# Altium project Ozgun_UKB_2025-2026.PrjPcb (part 3 of 4)
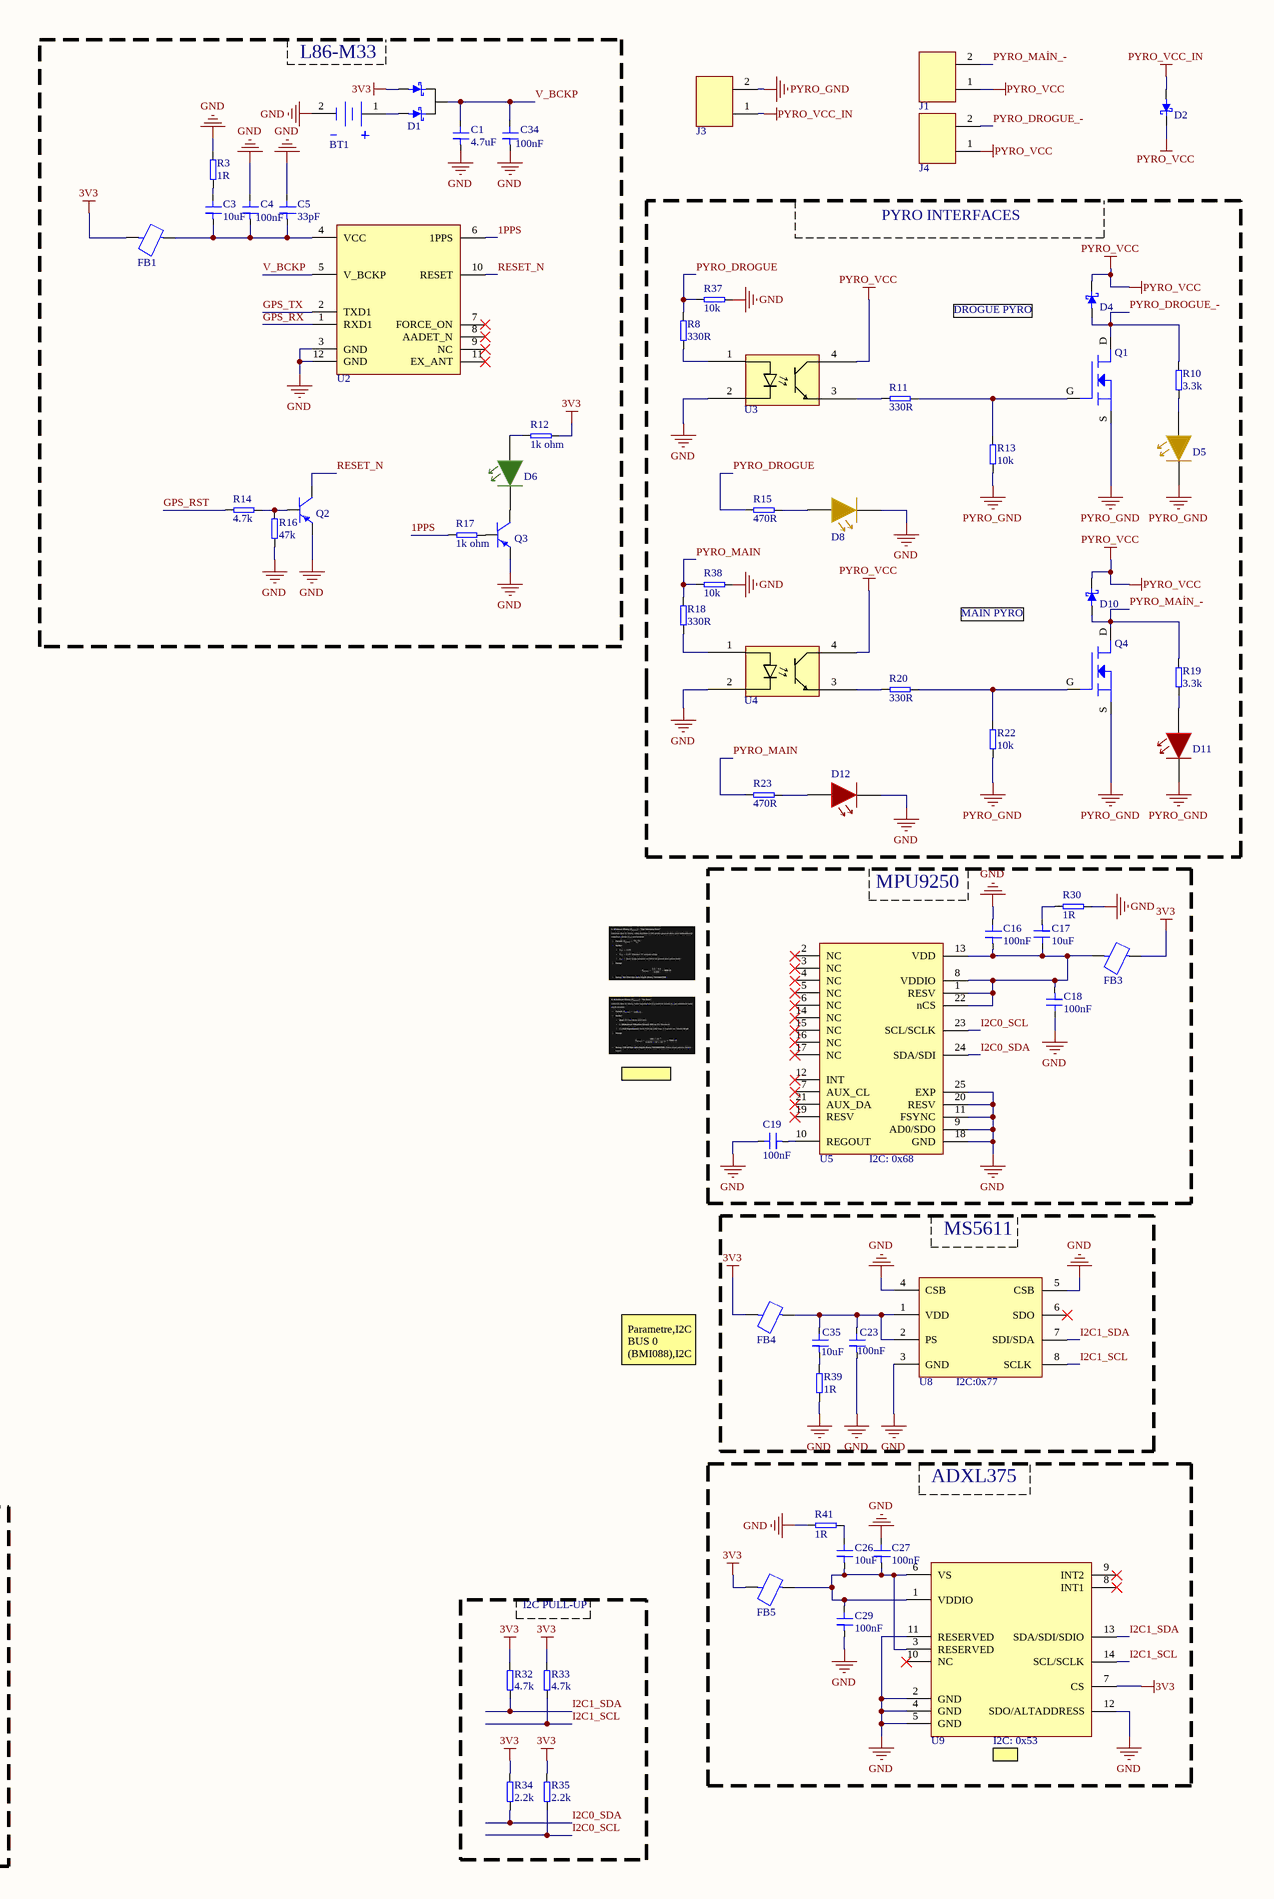
[diagram p3: Ucus_Kontrol_Bilgisayari.SchDoc, right]

## Sheet Ucus_Kontrol_Bilgisayari.SchDoc: AZAK ROKET TAKIMI ÖZGÜN UÇUŞ KONTROL BİLGİSAYARI (continued)

### Library data of the parts (continued)
D5 D8 = LED YELLOW 0805: Single Color LED, Brilliant Yellow, Water Clear, 1.4mm; Manufacturer: Everlight; Manufacturer Part Number: 17-21/Y2C-AN1P2/4T; Forward Current: 25mA; Forward Voltage: 2.4V; Luminous Intensity: 28.5mcd; Number of Circuits: 1; Peak Wavelength: 591nm; Reverse Voltage: 5V; Shape: Rectangular; Supplier: Future Electronics; Supplier Part Number: 6159094; RoHS: Compliant; Category: LEDs; Pricing: 4000=0,0337, 12000=0,0329, 20000=0,0326, 60000=0,0318, 100000=0,0311 (USD); Height: 1mm; Lifecycle Status: Production; Max Operating Temperature: 85°C; Min Operating Temperature: -40°C; Mounting Technology: Surface Mount; Number of Terminals: 2; REACH SVHC: Yes; Terminal Pitch: 1.6mm; Viewing Angle: 140°; ComponentLink1URL: https://datasheet.octopart.com:443/17-21-Y2C-AN1P2-4T-Everlight-datasheet-155996644.pdf?src-supplier=IHS; ComponentLink1Description: https://datasheet.octopart.com:443/17-21-Y2C-AN1P2-4T-Everlight-datasheet-155996644.pdf?src-supplier=IHS; ComponentLink2Description: Tedarikçi; ComponentLink2URL: https://www.ozdisan.com/p/sinyal-ledler-tek-renkli-361/everlight-17-21-y2c-an1p2-4t-952251
D7 D9 = D1FH3-5053: 30V, 3A, SMD Schottky Barrier Diode with 60A Surge; 1F Package Type; Manufacturer: Shindengen; Number of Elements: 1; Supplier: Mouser; Supplier Part Number: 627-D1FH35053; Manufacturer Part Number: D1FH3-5053; RoHS: Compliant; Category: Rectifier Diodes; Stock: 1555; Pricing: 1=0,93, 10=0,804, 50=0,804, 100=0,557, 1000=0,404, 10000=0,309 (USD); Lifecycle Status: Production; Max Forward Surge Current (Ifsm): 60A; Max Operating Temperature: 125°C; Max Output current: 3A; Number of Terminals: 2; REACH SVHC: No; Reverse Standoff Voltage: 30V; ComponentLink1URL: https://datasheet.octopart.com:443/D1FH3-5053-Shindengen-datasheet-38891300.pdf?src-supplier=IHS; ComponentLink1Description: https://datasheet.octopart.com:443/D1FH3-5053-Shindengen-datasheet-38891300.pdf?src-supplier=IHS; ComponentLink2Description: Tedarikçi; ComponentLink2URL: https://www.ozdisan.com/p/schottky-diyotlar-385/shindengen-d1fh3-5053-645670
D11 D12 D14 = LED RED 0805: Single Color LED, Brilliant Red, Water Clear, 1.4mm; Manufacturer: Everlight; Manufacturer Part Number: 17-21/R6C-AP1Q2L/4T; Forward Current: 25mA; Forward Voltage: 2.3V; Luminous Intensity: 45mcd; Number of Circuits: 1; Peak Wavelength: 632nm; Reverse Voltage: 5V; Shape: Rectangular; Viewing Angle: 140°; Supplier: Future Electronics; Supplier Part Number: 3156045; RoHS: Compliant; Category: LEDs; Pricing: 4000=0,0312, 12000=0,0305, 20000=0,0301, 60000=0,0294, 100000=0,0288 (USD); Height: 1mm; Lifecycle Status: Production; Max Operating Temperature: 85°C; Min Operating Temperature: -40°C; Mounting Technology: Surface Mount; Number of Terminals: 2; REACH SVHC: Yes; ComponentLink1URL: https://datasheet.octopart.com:443/17-21-R6C-AP1Q2L-4T-Everlight-datasheet-116384818.pdf?src-supplier=IHS; ComponentLink1Description: https://datasheet.octopart.com:443/17-21-R6C-AP1Q2L-4T-Everlight-datasheet-116384818.pdf?src-supplier=IHS; ComponentLink2Description: Tedarikçi; ComponentLink2URL: https://www.ozdisan.com/p/sinyal-ledler-tek-renkli-361/everlight-17-21-r6c-ap1q2l-4t-752951
D15 = 1.5SMCJ14A_R2_00001: Tepe Darbe Akımı (Maks) (Ippm): 64.7 A; Güç (Tepe Darbe): 1.5 kW; Yön: Uni-Direction; Diyot Konfigürasyonu: Single; TVS Diyot Tipi: Standard; ComponentLink1Description: Tedarikçi; ComponentLink1URL: https://www.ozdisan.com/p/tvs-diyotlar-386/panjit-1-5smcj14a-r2-00001-566508; Voltaj - Ters Standoff (Typ): 14 V; Montaj Tipi: SMT; Kılıf / Kasa: DO214AB (SMC)
D16 = P6SMBJ10AS_R1_00001: Trans Voltage Suppressor Diode, 600W, 10V V(RWM), Unidirectional, 1 Element, Silicon; Manufacturer: Panjit; Breakdown Voltage: 11.7V; Clamping Voltage: 17V; Max Breakdown Voltage: 12.3V; Max Power Dissipation: 5W; Min Breakdown Voltage: 11.1V; Number of Elements: 1; Peak Reverse Current: 5µA; Supplier: Mouser; Supplier Part Number: 241-P6SMBJ10ASR10000; Manufacturer Part Number: P6SMBJ10AS_R1_00001; RoHS: Compliant; Category: TVS Diodes; Pricing: 1=0,4, 10=0,248, 50=0,248, 100=0,157, 1000=0,094, 10000=0,094 (USD); Export Control Classification Number (ECCN) Code: EAR99; Harmonized Tariff Schedule (HTS) Code: 8541.10.00.50; Introduction Date: 2020-05-25; Lifecycle Status: Production; Max Operating Temperature: 150°C; Min Operating Temperature: -55°C; Number of Terminals: 2; Peak Pulse Power: 600W; Polarity: Unidirectional; REACH SVHC: No; Reverse Standoff Voltage: 10V; ComponentLink1URL: https://datasheet.octopart.com:443/P6SMBJ10AS_R1_00001-Panjit-datasheet-180982218.pdf?src-supplier=IHS; ComponentLink1Description: https://datasheet.octopart.com:443/P6SMBJ10AS_R1_00001-Panjit-datasheet-180982218.pdf?src-supplier=IHS; ComponentLink2Description: Tedarikçi; ComponentLink2URL: https://www.ozdisan.com/p/tvs-diyotlar-386/panjit-p6smbj10as-r1-00001-642916
FB1 FB3-FB5 = FERRİTE BEAD 0603 600R: Ferrite Beads Multi-Layer 600Ohm 25% 100MHz 500mA 350mOhm DCR 0603 Paper T/R; Manufacturer Part Number: BLM18EG601SN1D; DC Resistance (DCR): 350mΩ; Impedance: 700Ω; Material: Ferrite, Steel; Clock Frequency: 1GHz; Number of Circuits: 1; Value: 350mΩ; Shielding: Unshielded; ComponentLink1Description: Tedarikçi; ComponentLink1URL: https://www.ozdisan.com/p/bead-feritler-469/murata-blm18eg601sn1d-649375; Supplier: Mouser; Supplier Part Number: 81-BLM18EG601SN1D; Manufacturer: Murata; RoHS: Compliant; Category: Ferrite Beads and Chips; Stock: 195850; Pricing: 1=0,23, 10=0,163, 50=0,127, 100=0,114, 1000=0,075, 10000=0,058 (USD); Case/Package: 0603; Case Code (Imperial): 0603; Case Code (Metric): 1608; Contact Plating: Tin; Core Material: Ferrite; Current Rating: 500mA; DC Current: 500mA; Depth: 800µm; Frequency: 100MHz; Height: 800µm; Lead Free: Lead Free; Length: 1.6mm; Lifecycle Status: Production; Max Current Rating: 500mA; Max DC Current: 500mA; Max Operating Temperature: 125°C; Military Standard: Not; Min Operating Temperature: -55°C; Number of Lines: 1; Pins: 2; Number of Terminals: 2; Packaging: Cut Tape; Radiation Hardening: No; REACH SVHC: Yes; RMS Current (Irms): 500mA; Schedule B: 8504500000, 8504500000|8504500000|8504500000|8504500000|8504500000; ESR: 350mΩ; Termination: SMD/SMT; Test Frequency: 100MHz; Tolerance: 25%; Width: 800µm; ComponentLink2URL: https://datasheet.octopart.com:443/BLM18EG601SN1D-Murata-datasheet-165300960.pdf?src-supplier=IHS; ComponentLink2Description: https://datasheet.octopart.com:443/BLM18EG601SN1D-Murata-datasheet-165300960.pdf?src-supplier=IHS; ComponentLink3URL: https://datasheet.octopart.com:443/BLM18EG601SN1D-Murata-datasheet-66919.pdf?src-supplier=element14+APAC; ComponentLink3Description: https://datasheet.octopart.com:443/BLM18EG601SN1D-Murata-datasheet-66919.pdf?src-supplier=element14+APAC; ComponentLink4URL: https://datasheet.octopart.com:443/BLM18EG601SN1D-Murata-datasheet-11550679.pdf?src-supplier=_legacy+Avnet; ComponentLink4Description: https://datasheet.octopart.com:443/BLM18EG601SN1D-Murata-datasheet-11550679.pdf?src-supplier=_legacy+Avnet; ComponentLink5URL: https://datasheet.octopart.com:443/BLM18EG601SN1D-Murata-datasheet-8330444.pdf?src-supplier=_legacy+Avnet; ComponentLink5Description: https://datasheet.octopart.com:443/BLM18EG601SN1D-Murata-datasheet-8330444.pdf?src-supplier=_legacy+Avnet; ComponentLink6URL: https://datasheet.octopart.com:443/BLM18EG601SN1D-Murata-datasheet-584887.pdf?src-supplier=_legacy+Avnet; ComponentLink6Description: https://datasheet.octopart.com:443/BLM18EG601SN1D-Murata-datasheet-584887.pdf?src-supplier=_legacy+Avnet; ComponentLink7URL: https://datasheet.octopart.com:443/BLM18EG601SN1D-Murata-datasheet-141257939.pdf?src-supplier=Ciiva; ComponentLink7Description: https://datasheet.octopart.com:443/BLM18EG601SN1D-Murata-datasheet-141257939.pdf?src-supplier=Ciiva; ComponentLink8URL: https://datasheet.octopart.com:443/BLM18EG601SN1D-Murata-datasheet-138707008.pdf?src-supplier=Ciiva; ComponentLink8Description: https://datasheet.octopart.com:443/BLM18EG601SN1D-Murata-datasheet-138707008.pdf?src-supplier=Ciiva; ComponentLink9URL: https://datasheet.octopart.com:443/BLM18EG601SN1D-Murata-datasheet-113093584.pdf?src-supplier=Ciiva; ComponentLink9Description: https://datasheet.octopart.com:443/BLM18EG601SN1D-Murata-datasheet-113093584.pdf?src-supplier=Ciiva; ComponentLink10URL: https://datasheet.octopart.com:443/BLM18EG601SN1D-Murata-datasheet-135086666.pdf?src-supplier=TME; ComponentLink10Description: https://datasheet.octopart.com:443/BLM18EG601SN1D-Murata-datasheet-135086666.pdf?src-supplier=TME; ComponentLink11URL: https://datasheet.octopart.com:443/BLM18EG601SN1D-Murata-datasheet-62086314.pdf?src-supplier=Future+Electronics; ComponentLink11Description: https://datasheet.octopart.com:443/BLM18EG601SN1D-Murata-datasheet-62086314.pdf?src-supplier=Future+Electronics; ComponentLink12URL: https://datasheet.octopart.com/BLM18EG601SN1D-Murata-datasheet-37129980.pdf; ComponentLink12Description: https://datasheet.octopart.com/BLM18EG601SN1D-Murata-datasheet-37129980.pdf; ComponentLink13URL: https://datasheet.octopart.com:443/BLM18EG601SN1D-Murata-datasheet-8430085.pdf?src-supplier=Jameco; ComponentLink13Description: https://datasheet.octopart.com:443/BLM18EG601SN1D-Murata-datasheet-8430085.pdf?src-supplier=Jameco; ComponentLink14URL: http://sigma.octopart.com:80/reach_statement/Murata-company-16.pdf?src-supplier=Compliance+Statements; ComponentLink14Description: http://sigma.octopart.com:80/reach_statement/Murata-company-16.pdf?src-supplier=Compliance+Statements
FB2 FB6 = FERRİTE BEAD 0805 180R 4A: Ferrite Beads Multi-Layer Power 180Ohm 25% 100MHz 4A 0.02Ohm DCR 0805 T/R Automotive AEC-Q200; Manufacturer: Murata; Manufacturer Part Number: BLM21SP181SZ1D; Current Rating: 2.6A; DC Resistance (DCR): 20mΩ; Impedance: 180Ω; Number of Circuits: 1; Value: 20mΩ; Supplier: Mouser; Supplier Part Number: 81-BLM21SP181SZ1D; RoHS: Compliant; Category: Ferrite Beads and Chips; Stock: 11553; Pricing: 1=0,2, 10=0,167, 50=0,146, 100=0,138, 1000=0,106, 10000=0,094 (USD); Case/Package: 0805; Contact Plating: Tin; Core Material: Ferrite; Export Control Classification Number (ECCN) Code: EAR99; Height: 850µm; Harmonized Tariff Schedule (HTS) Code: 8504.50.80.00; Introduction Date: 2018-03-21; Length: 2mm; Lifecycle Status: Production; Max Operating Temperature: 125°C; Min Operating Temperature: -55°C; Number of Terminals: 2; REACH SVHC: Yes; RMS Current (Irms): 4A; Schedule B: 8504500000, 8543706000, 8543706000|8543706000|8543706000|8543706000|8543706000; ESR: 20mΩ; Test Frequency: 100MHz; Tolerance: 25%; Width: 1.25mm; ComponentLink1URL: https://datasheet.octopart.com:443/BLM21SP181SZ1D-Murata-datasheet-180807134.pdf?src-supplier=Newark; ComponentLink1Description: https://datasheet.octopart.com:443/BLM21SP181SZ1D-Murata-datasheet-180807134.pdf?src-supplier=Newark; ComponentLink2URL: https://datasheet.octopart.com:443/BLM21SP181SZ1D-Murata-datasheet-138707467.pdf?src-supplier=ODG+(Origin+Data+Global); ComponentLink2Description: https://datasheet.octopart.com:443/BLM21SP181SZ1D-Murata-datasheet-138707467.pdf?src-supplier=ODG+(Origin+Data+Global); ComponentLink3URL: http://sigma.octopart.com:80/reach_statement/Murata-company-16.pdf?src-supplier=Compliance+Statements; ComponentLink3Description: http://sigma.octopart.com:80/reach_statement/Murata-company-16.pdf?src-supplier=Compliance+Statements; ComponentLink4Description: Tedarikçi
  FB2: ComponentLink4URL: https://www.ozdisan.com/p/bead-feritler-469/murata-blm21sp181sz1d-650133?s=BLM21SP181SZ1D
  FB6: ComponentLink4URL: https://www.ozdisan.com/p/bead-feritler-469/murata-blm21sp181sz1d-650133https://www.ozdisan.com/p/bead-feritler-469/murata-blm21sp181sz1d-650133
J1-J4 = XT30: Konnektör Boyu: 13.70 mm; Gövde Kalınlığı: 5.20 mm; Gövde Genişliği: 10.20 mm; Pad Çapı (X/Y): 4.50 mm; Delik Çapı (Hole): 2.60 mm; Pin 1 - Pin 2 Aralığı: 5.00 mm; ComponentLink1Description: Datasheet; ComponentLink1URL: https://datasheet.octopart.com/XT30U-M-Amass-datasheet-165556442.pdf?src-supplier=TME; ComponentLink2Description: Tedarikçi; ComponentLink2URL: https://www.pilpaketi.com/xt30-erkek-disi-soket-takim-konnektor
J5 = USB4105-GF-A: USB Connector, 24 Contact(s), Female, Right Angle, Solder Terminal, Locking, Receptacle; Manufacturer: Global Connector Technology; Contact Resistance: 50mΩ; Current Rating: 6.25A; Dielectric Material: Liquid Crystal Polymer; Insulation Resistance: 100MΩ; Number of Contacts: 16; Number of Ports: 1; USB Standard: USB 2.0; Voltage Rating: 20V; ComponentLink1Description: Tedarikçi; ComponentLink1URL: https://www.ozdisan.com/p/usb-konnektorler-357/gct-usb4105-gf-a-955183; Supplier: Mouser; Supplier Part Number: 640-USB4105-GF-A; Manufacturer Part Number: USB4105-GF-A; RoHS: Compliant; Category: USB Connectors; Stock: 282614; Pricing: 1=0,78, 1=0,671, 10=0,659, 10=0,567, 25=0,506, 50=0,588, 100=0,56, 100=0,482, 250=0,452, 500=0,416, 800=0,384, 1000=0,447, 4000=0,362, 8000=0,351, 10000=0,408 (USD); China RoHS: Compliant; Contact Gender: Female; Contact Material: Gold, Nickel; Gender: Receptacle; Height: 3.46mm; Lifecycle Status: Production; Max Operating Temperature: 85°C; Min Operating Temperature: -40°C; Pins: 24; Number of Rows: 1; Orientation: Horizontal; REACH SVHC: Yes; Shell Finish: Nickel; Shell Material: Stainless Steel; Terminal Pitch: 500µm; ComponentLink2URL: https://datasheet.octopart.com:443/USB4105-GF-A-GCT-datasheet-166929323.pdf?src-supplier=SOS+electronic; ComponentLink2Description: https://datasheet.octopart.com:443/USB4105-GF-A-GCT-datasheet-166929323.pdf?src-supplier=SOS+electronic; ComponentLink3URL: https://datasheet.octopart.com:443/USB4105-GF-A-GCT-datasheet-188935996.pdf?src-supplier=TME; ComponentLink3Description: https://datasheet.octopart.com:443/USB4105-GF-A-GCT-datasheet-188935996.pdf?src-supplier=TME; ComponentLink4URL: https://datasheet.octopart.com:443/USB4105-GF-A-GCT-datasheet-188869076.pdf?src-supplier=TME; ComponentLink4Description: https://datasheet.octopart.com:443/USB4105-GF-A-GCT-datasheet-188869076.pdf?src-supplier=TME; ComponentLink5URL: https://datasheet.octopart.com:443/USB4105-GF-A-GCT-datasheet-166927665.pdf?src-supplier=TME; ComponentLink5Description: https://datasheet.octopart.com:443/USB4105-GF-A-GCT-datasheet-166927665.pdf?src-supplier=TME
J6 = PDI-09S-5: Right Angle, P.C.B., 5.0mm Footprint; ComponentLink1Description: Datasheet; ComponentLink1URL: https://datasheet.octopart.com/PDI-09S-Power-Dynamics-datasheet-12552829.pdf; ComponentLink2Description: Supplier; ComponentLink2URL: https://www.serelektronik.com.tr/urun/9-pin-pcb-tip-90-disi-d-sub-konnektor; ComponentLink3Description: Tedarikçi; ComponentLink3URL: https://www.ozdisan.com/p/d-sub-konnektorler-297/connfly-ds1037-09fnakt74-346546
L1 = INDUCTOR 3.3uH 6A 20mOhm SMD: Inductor Power Shielded Wirewound 3.3uH 20% 100KHz Iron 6A 0.03Ohm DCR T/R; Manufacturer: Bourns; Core Material: Ferrite; DC Resistance (DCR): 30mΩ; Value: 3.3µH; Number of Circuits: 1; RMS Current (Irms): 7A; Saturation Current: 10A; Shielding: Yes; Supplier: Mouser; Supplier Part Number: 652-SRP7030-3R3M; Manufacturer Part Number: SRP7030-3R3M; RoHS: Compliant; Category: Fixed Inductors; Stock: 731; Pricing: 1=0,9, 10=0,755, 50=0,754, 100=0,642, 1000=0,548, 10000=0,548 (USD); Case/Package: 2725; Composition: Wirewound; Contact Plating: Tin; Current Rating: 6A; DC Current: 6A; Depth: 7mm; Height: 3.2mm; Height - Seated (Max): 3.2004mm; Inductance Tolerance: 20%; Length: 7.8mm; Lifecycle Status: NRND; Material: Ferrite; Max Current Rating: 6A; Max DC Current: 6A; Max Operating Temperature: 125°C; Military Standard: Not; Min Operating Temperature: -40°C; Mounting Technology: Surface Mount; Pins: 2; Number of Terminals: 2; Packaging: Cut Tape; REACH SVHC: Yes; Schedule B: 8504500000, 8504500000|8504500000|8504500000|8504500000|8504500000; Termination: SMD/SMT; Test Frequency: 100kHz; Tolerance: 20%; Width: 6.47mm; ComponentLink1URL: https://datasheet.octopart.com:443/SRP7030-3R3M-Bourns-datasheet-154729963.pdf?src-supplier=Farnell; ComponentLink1Description: https://datasheet.octopart.com:443/SRP7030-3R3M-Bourns-datasheet-154729963.pdf?src-supplier=Farnell; ComponentLink2URL: https://datasheet.octopart.com:443/SRP7030-3R3M-Bourns-datasheet-28808747.pdf?src-supplier=Farnell; ComponentLink2Description: https://datasheet.octopart.com:443/SRP7030-3R3M-Bourns-datasheet-28808747.pdf?src-supplier=Farnell; ComponentLink3URL: https://datasheet.octopart.com:443/SRP7030-3R3M-Bourns-datasheet-21196329.pdf?src-supplier=Electro+Sonic; ComponentLink3Description: https://datasheet.octopart.com:443/SRP7030-3R3M-Bourns-datasheet-21196329.pdf?src-supplier=Electro+Sonic; ComponentLink4URL: https://datasheet.octopart.com:443/SRP7030-3R3M-Bourns-datasheet-11770050.pdf?src-supplier=element14; ComponentLink4Description: https://datasheet.octopart.com:443/SRP7030-3R3M-Bourns-datasheet-11770050.pdf?src-supplier=element14; ComponentLink5URL: https://datasheet.octopart.com:443/SRP7030-3R3M-Bourns-datasheet-8700700.pdf?src-supplier=element14; ComponentLink5Description: https://datasheet.octopart.com:443/SRP7030-3R3M-Bourns-datasheet-8700700.pdf?src-supplier=element14; ComponentLink6URL: https://datasheet.octopart.com:443/SRP7030-3R3M-Bourns-datasheet-8458199.pdf?src-supplier=element14; ComponentLink6Description: https://datasheet.octopart.com:443/SRP7030-3R3M-Bourns-datasheet-8458199.pdf?src-supplier=element14; ComponentLink7URL: https://datasheet.octopart.com:443/SRP7030-3R3M-Bourns-datasheet-34223514.pdf?src-supplier=RS+(Formerly+Allied+Electronics); ComponentLink7Description: https://datasheet.octopart.com:443/SRP7030-3R3M-Bourns-datasheet-34223514.pdf?src-supplier=RS+(Formerly+Allied+Electronics); ComponentLink8URL: https://datasheet.octopart.com:443/SRP7030-3R3M-Bourns-datasheet-24907092.pdf?src-supplier=RS+(Formerly+Allied+Electronics); ComponentLink8Description: https://datasheet.octopart.com:443/SRP7030-3R3M-Bourns-datasheet-24907092.pdf?src-supplier=RS+(Formerly+Allied+Electronics); ComponentLink9URL: http://sigma.octopart.com:80/conflict_mineral_statement/Bourns-company-36.pdf?src-supplier=Compliance+Statements; ComponentLink9Description: http://sigma.octopart.com:80/conflict_mineral_statement/Bourns-company-36.pdf?src-supplier=Compliance+Statements; ComponentLink10Description: Tedarikçi; ComponentLink10URL: https://www.ozdisan.com/p/sabit-induktorler-468/bourns-srp7030-3r3m-500911
LS1 = MTS7525A04LM: Sürücü Devresi: Without Circuit; Empedans: 16 Ohms; Giriş Tipi: Zero-Peak; Voltaj Değeri: 3.60 V; Voltaj Aralığı: 2.5-4.5 V; Frekans: 2.31 kHz; Ses Basınç Seviyesi: 85 dB @ 10cm; Besleme Akımı: 100 mA; Boyut: 7.5x7.5x2.5mm; ComponentLink1Description: Tedarikçi; ComponentLink1URL: https://www.ozdisan.com/p/buzzerlar-430/sound-comp-mts7525a04lm-448634; Teknoloji: Magnetic; Montaj Tipi: SMT
Q1 Q4 = BSC032NE2LSATMA1: Transistor: N-MOSFET; unipolar; 25V; 84A; 37W; PG-TDSON-8; Manufacturer: Infineon; Continuous Drain Current (ID): 22A; Drain to Source Resistance: 4.8mΩ; Gate to Source Voltage (Vgs): 20V; Input Capacitance: 1.2nF; Number of Elements: 1; On-State Resistance: 3.2mΩ; Rise Time: 2.8ns; Supplier: Mouser; Supplier Part Number: 726-BSC032NE2LSATMA1; Manufacturer Part Number: BSC032NE2LSATMA1; RoHS: Compliant; Category: MOSFETs; Stock: 5061; Pricing: 1=0,38, 10=0,376, 50=0,376, 100=0,342, 1000=0,329, 10000=0,268 (USD); China RoHS: Non-Compliant; Contact Plating: Tin; Drain to Source Voltage (Vdss): 25V; Halogen Free: Halogen Free; Lead Free: Contains Lead; Lifecycle Status: Production; Max Dual Supply Voltage: 25V; Max Operating Temperature: 150°C; Max Power Dissipation: 37W; Min Breakdown Voltage: 25V; Min Operating Temperature: -55°C; Mounting Technology: Surface Mount; Pins: 8; Number of Terminals: 8; Package Quantity: 5000; Packaging: Tape & Reel; Power Dissipation: 37W; Rds On Max: 3.2mΩ; REACH SVHC: No; Schedule B: 8541290080, 8541290080|8541290080, 8541290080|8541290080|8541290080, 8541290080|8541290080|8541290080|8541290080; ComponentLink1URL: https://datasheet.octopart.com:443/BSC032NE2LSATMA1-Infineon-datasheet-62293614.pdf?src-supplier=IHS; ComponentLink1Description: https://datasheet.octopart.com:443/BSC032NE2LSATMA1-Infineon-datasheet-62293614.pdf?src-supplier=IHS; ComponentLink2URL: https://datasheet.octopart.com:443/BSC032NE2LS-Infineon-datasheet-180053178.pdf?src-supplier=IHS; ComponentLink2Description: https://datasheet.octopart.com:443/BSC032NE2LS-Infineon-datasheet-180053178.pdf?src-supplier=IHS; ComponentLink3URL: https://datasheet.octopart.com:443/BSC032NE2LSATMA1-Infineon-datasheet-11748125.pdf?src-supplier=Factory+Futures; ComponentLink3Description: https://datasheet.octopart.com:443/BSC032NE2LSATMA1-Infineon-datasheet-11748125.pdf?src-supplier=Factory+Futures; ComponentLink4URL: http://sigma.octopart.com:80/conflict_mineral_statement/Infineon-company-51.pdf?src-supplier=Compliance+Statements; ComponentLink4Description: http://sigma.octopart.com:80/conflict_mineral_statement/Infineon-company-51.pdf?src-supplier=Compliance+Statements; ComponentLink5Description: Tedarikçi; ComponentLink5URL: https://www.ozdisan.com/p/discrete-mosfetler-435/infineon-bsc032ne2lsatma1-482283
Q2 Q3 Q5 = MMBT4401-TP: Trans Gp Bjt NPN 40V 0.6A 350MW 3-PIN SOT-23 T/r; Manufacturer: MCC; Collector Base Voltage (VCBO): 60V; Collector Emitter Saturation Voltage: 750mV; Current Rating: 600mA; Element Configuration: Single; Emitter Base Voltage (VEBO): 6V; Frequency: 250MHz; hFE Min: 80; Number of Elements: 1; Supplier: Mouser; Supplier Part Number: 833-MMBT4401-TP; Manufacturer Part Number: MMBT4401-TP; RoHS: Compliant; Category: BJTs; Stock: 30545; Pricing: 1=0,12, 10=0,072, 50=0,072, 100=0,045, 1000=0,028, 10000=0,016 (USD); Case/Package: SOT-23; China RoHS: Compliant; Collector Emitter Breakdown Voltage: 40V; Collector Emitter Voltage (VCEO): 40V; Gain Bandwidth Product: 250MHz; Height: 1.12mm; Lead Free: Lead Free; Length: 3.04mm; Lifecycle Status: Production; Max Breakdown Voltage: 40V; Max Collector Current: 600mA; Clock Frequency: 250MHz; Max Operating Temperature: 150°C; Max Power Dissipation: 350mW; Min Operating Temperature: -55°C; Mounting Technology: Surface Mount; Pins: 3; Number of Terminals: 3; Packaging: Cut Tape; Polarity: NPN; Power Dissipation: 350mW; Radiation Hardening: No; REACH SVHC: Yes; Schedule B: 8541210080, 8541210080|8541210080|8541210080|8541210080|8541210080|8541210080|8541210080|8541210080|8541210080|8541210080|8541210080|8541210080|8541210080|8541210080|8541210080|8541210080|8541210080|8541210080|8541210080|8541210080|8541210080|8541210080|8541210080|85; Transition Frequency: 250MHz; Voltage Rating (DC): 40V; Width: 1.4mm; ComponentLink1URL: https://datasheet.octopart.com:443/MMBT4401-TP-Micro-Commercial-datasheet-21204993.pdf?src-supplier=Farnell; ComponentLink1Description: https://datasheet.octopart.com:443/MMBT4401-TP-Micro-Commercial-datasheet-21204993.pdf?src-supplier=Farnell; ComponentLink2URL: https://datasheet.octopart.com:443/MMBT4401-TP-Micro-Commercial-datasheet-21392908.pdf?src-supplier=Farnell; ComponentLink2Description: https://datasheet.octopart.com:443/MMBT4401-TP-Micro-Commercial-datasheet-21392908.pdf?src-supplier=Farnell; ComponentLink3URL: https://datasheet.octopart.com:443/MMBT4401-TP-Micro-Commercial-datasheet-11746504.pdf?src-supplier=Arrow+Electronics; ComponentLink3Description: https://datasheet.octopart.com:443/MMBT4401-TP-Micro-Commercial-datasheet-11746504.pdf?src-supplier=Arrow+Electronics; ComponentLink4URL: https://datasheet.octopart.com:443/MMBT4401-TP-Micro-Commercial-datasheet-9983324.pdf?src-supplier=RS+(Formerly+Allied+Electronics); ComponentLink4Description: https://datasheet.octopart.com:443/MMBT4401-TP-Micro-Commercial-datasheet-9983324.pdf?src-supplier=RS+(Formerly+Allied+Electronics); ComponentLink5URL: https://datasheet.octopart.com:443/MMBT4401-TP-Micro-Commercial-datasheet-87121.pdf?src-supplier=DigiKey; ComponentLink5Description: https://datasheet.octopart.com:443/MMBT4401-TP-Micro-Commercial-datasheet-87121.pdf?src-supplier=DigiKey; ComponentLink6Description: Tedarikçi; ComponentLink6URL: https://www.ozdisan.com/p/discrete-transistorler-442/m-c-c-mmbt4401-tp-1211020
R1 = RES 69.8kOhm %1 SMD 0603: RES.(1608) 0603 69.8K Ohms 1% 1/10W-S 100PPM; Manufacturer: Royal Ohm; Manufacturer Part Number: 0603SAF6982T5E; Supplier: Mouser; Supplier Part Number: 303-0603SAF6982T5E; Category: Uncategorized; Pricing: 10000=0,001 (USD); ComponentLink1Description: Tedarikçi; ComponentLink1URL: https://www.ozdisan.com/p/smt-smd-ve-cip-direncler-194/royalohm-0603saf6982t5e-505954
R2 R15 R23 = RES  470 Ohm %1 SMD 0603: RES.(1608) 0603 470 Ohms 1% 1/10W AUTOMOTIV; Manufacturer: Royal Ohm; Manufacturer Part Number: CQ03SAF4700T5E; Value: 470Ω; Supplier: Mouser; Supplier Part Number: 303-CQ03SAF4700T5E; Category: Uncategorized; Pricing: 10000=0,001 (USD); ComponentLink1URL: https://datasheet.octopart.com:443/CQ03SAF4700T5E-Royal-Ohm-datasheet-159080023.pdf?src-supplier=TME; ComponentLink1Description: https://datasheet.octopart.com:443/CQ03SAF4700T5E-Royal-Ohm-datasheet-159080023.pdf?src-supplier=TME; ComponentLink2URL: https://datasheet.octopart.com:443/CQ03SAF4700T5E-Royal-Ohm-datasheet-140586692.pdf?src-supplier=TME; ComponentLink2Description: https://datasheet.octopart.com:443/CQ03SAF4700T5E-Royal-Ohm-datasheet-140586692.pdf?src-supplier=TME; ComponentLink3Description: Tedarikçi; ComponentLink3URL: https://www.ozdisan.com/p/smt-smd-ve-cip-direncler-194/royalohm-cq03saf4700t5e-587949
R3 R30 R39-R41 = RES 1R Ohm %1 SMD 0603: RES.(1608) 0603 1 Ohms 1% 1/10W AUTOMOTIV; Manufacturer: Royal Ohm; Manufacturer Part Number: CQ03SAF100KT5E; Value: 1Ω; Supplier: Mouser; Supplier Part Number: 303-CQ03SAF100KT5E; Category: Uncategorized; Pricing: 10000=0,002 (USD); ComponentLink1Description: Tedarikçi; ComponentLink1URL: https://www.ozdisan.com/p/smt-smd-ve-cip-direncler-194/royalohm-cq03saf100kt5e-587589
R4 = RES 22.1K Ohms 1% SMD 0603: Res Thick Film 0603 22.1K Ohm 1% 0.1W(1/10W) ±100ppm/°C Pad SMD T/R; Manufacturer: Royal Ohm; Manufacturer Part Number: 0603SAF2212T5E; Value: 22.1kΩ; Supplier: Mouser; Supplier Part Number: 303-0603SAF2212T5E; Category: Uncategorized; Pricing: 10000=0,001 (USD); Temperature Coefficient: 100ppm/°C; ComponentLink1URL: https://datasheet.octopart.com:443/0603SAF2212T5E-Royal-Ohm-datasheet-165785611.pdf?src-supplier=TME; ComponentLink1Description: https://datasheet.octopart.com:443/0603SAF2212T5E-Royal-Ohm-datasheet-165785611.pdf?src-supplier=TME; ComponentLink2URL: https://datasheet.octopart.com:443/0603SAF2212T5E-Royal-Ohm-datasheet-157855877.pdf?src-supplier=TME; ComponentLink2Description: https://datasheet.octopart.com:443/0603SAF2212T5E-Royal-Ohm-datasheet-157855877.pdf?src-supplier=TME; ComponentLink3URL: https://datasheet.octopart.com:443/0603SAF2212T5E-Royal-Ohm-datasheet-62069544.pdf?src-supplier=TME; ComponentLink3Description: https://datasheet.octopart.com:443/0603SAF2212T5E-Royal-Ohm-datasheet-62069544.pdf?src-supplier=TME; ComponentLink4URL: https://datasheet.octopart.com:443/0603SAF2212T5E-Royal-Ohm-datasheet-17591904.pdf?src-supplier=TME; ComponentLink4Description: https://datasheet.octopart.com:443/0603SAF2212T5E-Royal-Ohm-datasheet-17591904.pdf?src-supplier=TME; ComponentLink5Description: Tedarikçi; ComponentLink5URL: https://www.ozdisan.com/p/smt-smd-ve-cip-direncler-194/royalohm-0603saf2212t5e-505926
R5 R13 R22 = RES 10kOhm %5 SMD 0603: (RC0603JR-0710KL) SMD Chip Resistor, 10 kOhm, ï¿½ 5%, 100 mW, 0603 [1608 Metric], Thick Film, General Purpose; Manufacturer: Yageo; Value: 10kR; Temperature Coefficient: 100ppm/°C; Max Power Dissipation: 100mW; Voltage Rating (AC): 50V; Designed by: Eren/Mehmet; Supplier: Mouser; Supplier Part Number: 603-RC0603JR-0710KL; Manufacturer Part Number: RC0603JR-0710KL; RoHS: Yes; Category: Chip SMD Resistors; Stock: 1942230; Pricing: 1=0,1, 10=0,009, 50=0,009, 100=0,006, 1000=0,005, 10000=0,002 (USD); Case/Package: 0603; Min Operating Temperature: -55°C; Max Operating Temperature: 155°C; Tolerance: 5%; Number of Terminations: 2; Series: RC; Reach SVHC Compliant: 4187SVHC; Lead Free: 5697LeadFree; RoHS Compliant: Yes; ComponentLink1URL: https://datasheet.ciiva.com/2452/pyu-rc-group-51-rohs-l-10-2452848.pdf?src-supplier=Digikey; ComponentLink1Description: https://datasheet.ciiva.com/2452/pyu-rc-group-51-rohs-l-10-2452848.pdf?src-supplier=Digikey; ComponentLink2Description: https://ozdisan.com/pasif-komponentler/direncler/smt-smd-ve-cip-direncler/RC0603JR-0710KL/383150; ComponentLink2URL: https://ozdisan.com/pasif-komponentler/direncler/smt-smd-ve-cip-direncler/RC0603JR-0710KL/383150; ComponentLink3Description: Tedarikçi; ComponentLink3URL: https://www.ozdisan.com/p/SMT-SMD-and-Chip-Resistors-194/yageo-rc0603jr-0710kl-383150
R6 = RES 200kOhm %1 SMD 0603: (0603SAF2003T5E) Res Thick Film 0603 200K Ohm 1% 0.1W(1/10W) ±100ppm/°C Pad SMD T/R; Manufacturer: Royal Electronic Factory; Designed by: Eren/Mehmet; ComponentLink1URL: https://datasheet.octopart.com/0603SAJ0204T5E-Royal-Ohm-datasheet-165785611.pdf?src-supplier=TME; ComponentLink1Description: https://datasheet.octopart.com/0603SAJ0204T5E-Royal-Ohm-datasheet-165785611.pdf?src-supplier=TME; ComponentLink2Description: https://ozdisan.com/pasif-komponentler/direncler/smt-smd-ve-cip-direncler/0603SAF2003T5E/339337; ComponentLink2URL: https://ozdisan.com/pasif-komponentler/direncler/smt-smd-ve-cip-direncler/0603SAF2003T5E/339337; Supplier: Mouser; Supplier Part Number: 303-0603SAF2003T5E; Manufacturer Part Number: 0603SAF2003T5E; RoHS: Yes; Stock: 170000; Pricing: 10000=0,001 (USD); ComponentLink3URL: https://datasheet.octopart.com/0603SAF2003T5E-Royal-Ohm-datasheet-165785611.pdf?src-supplier=TME; ComponentLink3Description: https://datasheet.octopart.com/0603SAF2003T5E-Royal-Ohm-datasheet-165785611.pdf?src-supplier=TME
R7 R9 R21 R31 R36-R38 R42 = RES 10kOhm %1 SMD 0603: 100mW Thick Film Resistors ±100ppm/℃ ±1% 10kΩ 0603 Chip Resistor - Surface Mount ROHS; Manufacturer: Yageo Group; Manufacturer Part Number: RC0603FR-0710KL; Temperature Coefficient: 100ppm/°C; Voltage Rating: 75V; Voltage Rating (DC): 50V; Supplier: Mouser; Supplier Part Number: 603-RC0603FR-0710KL; RoHS: Compliant; Category: Chip SMD Resistors; Stock: 6497070; Pricing: 1=0,1, 10=0,006, 50=0,006, 100=0,006, 1000=0,006, 10000=0,002 (USD); Case/Package: 0603; Case Code (Imperial): 0603; Case Code (Metric): 0603; China RoHS: Non-Compliant; Composition: Thick Film; Depth: 800µm; Height: 450µm; Lead Free: Lead Free; Lead Pitch: 300µm; Length: 1.6mm; Lifecycle Status: Production; Max Operating Temperature: 155°C; Military Standard: Not; Min Operating Temperature: -55°C; Mounting Technology: Surface Mount; Pins: 2; Number of Terminals: 2; Packaging: Tape & Reel; Power Dissipation: 100mW; Power Rating: 100mW; REACH SVHC: Yes; Value: 10kΩ; Schedule B: 8533210045, 8533210045|8533210045|8533210045|8533210045|8533210045|8533210045|8533210045|8533210045|8533210045|8533210045|8533210045|8533210045|8533210045|8533210045|8533210045|8533210045|8533210045|8533210045|8533210045|8533210045|8533210045|8533210045|8533210045|85; Termination: SMD/SMT; Tolerance: 1%; Weight: 2.012816mg; Width: 800µm; Working Voltage: 75V; ComponentLink1URL: https://datasheet.octopart.com:443/RC0603FR-0710KL-Yageo-datasheet-175887523.pdf?src-supplier=IHS; ComponentLink1Description: https://datasheet.octopart.com:443/RC0603FR-0710KL-Yageo-datasheet-175887523.pdf?src-supplier=IHS; ComponentLink2URL: https://datasheet.octopart.com:443/RC0603FR-0710KL-Yageo-datasheet-103092701.pdf?src-supplier=Upverter; ComponentLink2Description: https://datasheet.octopart.com:443/RC0603FR-0710KL-Yageo-datasheet-103092701.pdf?src-supplier=Upverter; ComponentLink3URL: https://datasheet.octopart.com:443/RC0603FR-0710KL-Yageo-datasheet-98239111.pdf?src-supplier=Upverter; ComponentLink3Description: https://datasheet.octopart.com:443/RC0603FR-0710KL-Yageo-datasheet-98239111.pdf?src-supplier=Upverter; ComponentLink4URL: https://datasheet.octopart.com:443/RC0603FR-0710KL-Yageo-datasheet-141265859.pdf?src-supplier=Upverter; ComponentLink4Description: https://datasheet.octopart.com:443/RC0603FR-0710KL-Yageo-datasheet-141265859.pdf?src-supplier=Upverter; ComponentLink5URL: https://sigma.octopart.com:443/138820526/technical_drawing/Yageo-RC0603FR-0710KL.pdf?src-supplier=Upverter; ComponentLink5Description: https://sigma.octopart.com:443/138820526/technical_drawing/Yageo-RC0603FR-0710KL.pdf?src-supplier=Upverter; ComponentLink6URL: https://datasheet.octopart.com:443/RC0603FR-0710KL-Yageo-datasheet-8328172.pdf?src-supplier=Farnell; ComponentLink6Description: https://datasheet.octopart.com:443/RC0603FR-0710KL-Yageo-datasheet-8328172.pdf?src-supplier=Farnell; ComponentLink7URL: https://datasheet.octopart.com:443/RC0603FR-0710KL-Yageo-datasheet-13691069.pdf?src-supplier=Farnell; ComponentLink7Description: https://datasheet.octopart.com:443/RC0603FR-0710KL-Yageo-datasheet-13691069.pdf?src-supplier=Farnell; ComponentLink8URL: https://datasheet.octopart.com:443/RC0603FR-0710KL-Yageo-datasheet-62067350.pdf?src-supplier=element14+APAC; ComponentLink8Description: https://datasheet.octopart.com:443/RC0603FR-0710KL-Yageo-datasheet-62067350.pdf?src-supplier=element14+APAC; ComponentLink9URL: https://datasheet.octopart.com:443/RC0603FR-0710KL-Yageo-datasheet-17842380.pdf?src-supplier=element14+APAC; ComponentLink9Description: https://datasheet.octopart.com:443/RC0603FR-0710KL-Yageo-datasheet-17842380.pdf?src-supplier=element14+APAC; ComponentLink10URL: https://datasheet.octopart.com:443/RC0603FR-0710KL-Yageo-datasheet-15599030.pdf?src-supplier=Future+Electronics; ComponentLink10Description: https://datasheet.octopart.com:443/RC0603FR-0710KL-Yageo-datasheet-15599030.pdf?src-supplier=Future+Electronics; ComponentLink11URL: https://datasheet.octopart.com:443/RC0603FR-0710KL-Yageo-datasheet-164759695.pdf?src-supplier=Future+Electronics; ComponentLink11Description: https://datasheet.octopart.com:443/RC0603FR-0710KL-Yageo-datasheet-164759695.pdf?src-supplier=Future+Electronics; ComponentLink12URL: https://datasheet.octopart.com:443/RC0603FR-0710KL-Yageo-datasheet-127823281.pdf?src-supplier=Future+Electronics; ComponentLink12Description: https://datasheet.octopart.com:443/RC0603FR-0710KL-Yageo-datasheet-127823281.pdf?src-supplier=Future+Electronics; ComponentLink13URL: https://datasheet.octopart.com:443/RC0603FR-0710KL-Yageo-datasheet-137700087.pdf?src-supplier=Future+Electronics; ComponentLink13Description: https://datasheet.octopart.com:443/RC0603FR-0710KL-Yageo-datasheet-137700087.pdf?src-supplier=Future+Electronics; ComponentLink14URL: https://datasheet.octopart.com:443/RC0603FR-0710KL-Yageo-datasheet-27584510.pdf?src-supplier=Future+Electronics; ComponentLink14Description: https://datasheet.octopart.com:443/RC0603FR-0710KL-Yageo-datasheet-27584510.pdf?src-supplier=Future+Electronics; ComponentLink15URL: https://datasheet.octopart.com:443/RC0603FR-0710KL-Yageo-datasheet-8324193.pdf?src-supplier=Future+Electronics; ComponentLink15Description: https://datasheet.octopart.com:443/RC0603FR-0710KL-Yageo-datasheet-8324193.pdf?src-supplier=Future+Electronics; ComponentLink16URL: https://datasheet.octopart.com:443/RC0603FR-0710KL-Yageo-datasheet-12596169.pdf?src-supplier=Newark; ComponentLink16Description: https://datasheet.octopart.com:443/RC0603FR-0710KL-Yageo-datasheet-12596169.pdf?src-supplier=Newark; ComponentLink17URL: https://datasheet.octopart.com:443/RC0603FR-0710KL-Yageo-datasheet-503470.pdf?src-supplier=Newark; ComponentLink17Description: https://datasheet.octopart.com:443/RC0603FR-0710KL-Yageo-datasheet-503470.pdf?src-supplier=Newark; ComponentLink18URL: https://datasheet.octopart.com:443/RC0603FR-0710KL-Yageo-datasheet-34211833.pdf?src-supplier=Newark; ComponentLink18Description: https://datasheet.octopart.com:443/RC0603FR-0710KL-Yageo-datasheet-34211833.pdf?src-supplier=Newark; ComponentLink19URL: https://datasheet.octopart.com:443/RC0603FR-0710KL-Yageo-datasheet-79472498.pdf?src-supplier=Megastar; ComponentLink19Description: https://datasheet.octopart.com:443/RC0603FR-0710KL-Yageo-datasheet-79472498.pdf?src-supplier=Megastar; ComponentLink20URL: https://datasheet.octopart.com/RC0603FR-0710KL-Yageo-datasheet-73766026.pdf; ComponentLink20Description: https://datasheet.octopart.com/RC0603FR-0710KL-Yageo-datasheet-73766026.pdf; ComponentLink21URL: https://datasheet.octopart.com:443/RC0603FR-0710KL-Yageo-datasheet-118562.pdf?src-supplier=DigiKey; ComponentLink21Description: https://datasheet.octopart.com:443/RC0603FR-0710KL-Yageo-datasheet-118562.pdf?src-supplier=DigiKey; ComponentLink22URL: http://sigma.octopart.com:80/rohs_statement/Yageo-company-2.pdf?src-supplier=Compliance+Statements; ComponentLink22Description: http://sigma.octopart.com:80/rohs_statement/Yageo-company-2.pdf?src-supplier=Compliance+Statements; ComponentLink23URL: http://sigma.octopart.com:80/conflict_mineral_statement/Yageo-company-3.pdf?src-supplier=Compliance+Statements; ComponentLink23Description: http://sigma.octopart.com:80/conflict_mineral_statement/Yageo-company-3.pdf?src-supplier=Compliance+Statements; ComponentLink24Description: Tedarikçi; ComponentLink24URL: https://www.ozdisan.com/p/smt-smd-ve-cip-direncler-194/yageo-rc0603fr-0710kl-379294
R8 R11 R18 R20 = RES 330Ohm %1 SMD 0603: 100Mw Thick Film Resistors 100Ppm/ 1% 330 0603 Chip Resistor Surface Mount Rohs; Manufacturer: Yageo Group; Manufacturer Part Number: RC0603FR-07330RL; Designed by: Eren; Value: 47µF; ESR (Equivalent Series Resistance): 800mΩ; Temperature Coefficient: 100ppm/°C; Voltage Rating: 16V; Voltage Rating (AC): 50V; Working Voltage: 75V; ComponentLink1Description: Supplier; ComponentLink1URL: https://www.ozdisan.com/p/smt-smd-ve-cip-direncler-194/yageo-rc0603fr-07330rl-618039; ComponentLink2Description: Datasheet; ComponentLink2URL: https://cdn.ozdisan.com/ETicaret_Dosya/1054480_1096814818..pdf; Supplier: Mouser; Supplier Part Number: 603-RC0603FR-07330RL; RoHS: Compliant; Category: Chip SMD Resistors; Pricing: 1=0,1, 10=0,008, 50=0,008, 100=0,006, 1000=0,005, 10000=0,002 (USD); Case/Package: 2917; Case Code (Imperial): 2917; Case Code (Metric): 7343; China RoHS: Non-Compliant; Composition: Thick Film; Depth: 800µm; Features: Moisture Resistant; Height: 450µm; Lead Free: Lead Free; Length: 7.3mm; Lifecycle Status: Production; Max Operating Temperature: 155°C; Max Power Dissipation: 100mW; Min Operating Temperature: -55°C; Mounting Technology: Surface Mount; Pins: 2; Number of Terminals: 2; Number of Terminations: 2; Packaging: Tape and Reel; Power Dissipation: 100mW; Power Rating: 100mW; Radiation Hardening: No; REACH SVHC: Yes; Schedule B: 8533210045, 8533210045|8533210045, 8533210045|8533210045|8533210045, 8533210045|8533210045|8533210045|8533210045; Termination: SMD/SMT; Tolerance: 1%; Voltage Rating (DC): 16V; Width: 800µm; ComponentLink3URL: https://datasheet.octopart.com:443/RC0603FR-07330RL-Yageo-datasheet-175887523.pdf?src-supplier=IHS; ComponentLink3Description: https://datasheet.octopart.com:443/RC0603FR-07330RL-Yageo-datasheet-175887523.pdf?src-supplier=IHS; ComponentLink4URL: https://datasheet.octopart.com:443/RC0603FR-07330RL-Yageo-datasheet-62067350.pdf?src-supplier=Newark; ComponentLink4Description: https://datasheet.octopart.com:443/RC0603FR-07330RL-Yageo-datasheet-62067350.pdf?src-supplier=Newark; ComponentLink5URL: https://datasheet.octopart.com:443/RC0603FR-07330RL-Yageo-datasheet-12596169.pdf?src-supplier=Newark; ComponentLink5Description: https://datasheet.octopart.com:443/RC0603FR-07330RL-Yageo-datasheet-12596169.pdf?src-supplier=Newark; ComponentLink6URL: https://datasheet.octopart.com:443/RC0603FR-07330RL-Yageo-datasheet-503470.pdf?src-supplier=Newark; ComponentLink6Description: https://datasheet.octopart.com:443/RC0603FR-07330RL-Yageo-datasheet-503470.pdf?src-supplier=Newark; ComponentLink7URL: https://datasheet.octopart.com:443/RC0603FR-07330RL-Yageo-datasheet-34211833.pdf?src-supplier=Newark; ComponentLink7Description: https://datasheet.octopart.com:443/RC0603FR-07330RL-Yageo-datasheet-34211833.pdf?src-supplier=Newark; ComponentLink8URL: https://datasheet.octopart.com:443/RC0603FR-07330RL-Yageo-datasheet-103092701.pdf?src-supplier=Upverter; ComponentLink8Description: https://datasheet.octopart.com:443/RC0603FR-07330RL-Yageo-datasheet-103092701.pdf?src-supplier=Upverter; ComponentLink9URL: https://datasheet.octopart.com:443/RC0603FR-07330RL-Yageo-datasheet-98239111.pdf?src-supplier=Upverter; ComponentLink9Description: https://datasheet.octopart.com:443/RC0603FR-07330RL-Yageo-datasheet-98239111.pdf?src-supplier=Upverter; ComponentLink10URL: https://datasheet.octopart.com:443/RC0603FR-07330RL-Yageo-datasheet-8328172.pdf?src-supplier=element14+APAC; ComponentLink10Description: https://datasheet.octopart.com:443/RC0603FR-07330RL-Yageo-datasheet-8328172.pdf?src-supplier=element14+APAC; ComponentLink11URL: https://datasheet.octopart.com:443/RC0603FR-07330RL-Yageo-datasheet-15599030.pdf?src-supplier=Future+Electronics; ComponentLink11Description: https://datasheet.octopart.com:443/RC0603FR-07330RL-Yageo-datasheet-15599030.pdf?src-supplier=Future+Electronics; ComponentLink12URL: https://datasheet.octopart.com:443/RC0603FR-07330RL-Yageo-datasheet-164759695.pdf?src-supplier=Future+Electronics; ComponentLink12Description: https://datasheet.octopart.com:443/RC0603FR-07330RL-Yageo-datasheet-164759695.pdf?src-supplier=Future+Electronics; ComponentLink13URL: https://datasheet.octopart.com:443/RC0603FR-07330RL-Yageo-datasheet-137700087.pdf?src-supplier=Future+Electronics; ComponentLink13Description: https://datasheet.octopart.com:443/RC0603FR-07330RL-Yageo-datasheet-137700087.pdf?src-supplier=Future+Electronics; ComponentLink14URL: https://datasheet.octopart.com:443/RC0603FR-07330RL-Yageo-datasheet-27584510.pdf?src-supplier=Future+Electronics; ComponentLink14Description: https://datasheet.octopart.com:443/RC0603FR-07330RL-Yageo-datasheet-27584510.pdf?src-supplier=Future+Electronics; ComponentLink15URL: https://datasheet.octopart.com:443/RC0603FR-07330RL-Yageo-datasheet-8324193.pdf?src-supplier=Future+Electronics; ComponentLink15Description: https://datasheet.octopart.com:443/RC0603FR-07330RL-Yageo-datasheet-8324193.pdf?src-supplier=Future+Electronics; ComponentLink16URL: https://datasheet.octopart.com:443/RC0603FR-07330RL-Yageo-datasheet-79472498.pdf?src-supplier=Megastar; ComponentLink16Description: https://datasheet.octopart.com:443/RC0603FR-07330RL-Yageo-datasheet-79472498.pdf?src-supplier=Megastar; ComponentLink17URL: https://datasheet.octopart.com/RC0603FR-07330RL-Yageo-datasheet-73766026.pdf; ComponentLink17Description: https://datasheet.octopart.com/RC0603FR-07330RL-Yageo-datasheet-73766026.pdf; ComponentLink18URL: https://datasheet.octopart.com:443/RC0603FR-07330RL-Yageo-datasheet-13691069.pdf?src-supplier=Farnell; ComponentLink18Description: https://datasheet.octopart.com:443/RC0603FR-07330RL-Yageo-datasheet-13691069.pdf?src-supplier=Farnell; ComponentLink19URL: https://datasheet.octopart.com:443/RC0603FR-07330RL-Yageo-datasheet-118562.pdf?src-supplier=DigiKey; ComponentLink19Description: https://datasheet.octopart.com:443/RC0603FR-07330RL-Yageo-datasheet-118562.pdf?src-supplier=DigiKey; ComponentLink20URL: http://sigma.octopart.com:80/rohs_statement/Yageo-company-2.pdf?src-supplier=Compliance+Statements; ComponentLink20Description: http://sigma.octopart.com:80/rohs_statement/Yageo-company-2.pdf?src-supplier=Compliance+Statements; ComponentLink21URL: http://sigma.octopart.com:80/conflict_mineral_statement/Yageo-company-3.pdf?src-supplier=Compliance+Statements; ComponentLink21Description: http://sigma.octopart.com:80/conflict_mineral_statement/Yageo-company-3.pdf?src-supplier=Compliance+Statements
R10 R19 = RES 3.3kOhm %5 SMD 0603: Res Thick Film 0603 3.3K Ohm 5% 0.1W(1/10W) ±100ppm/C Pad SMD T/R; Manufacturer: Royal Ohm; Manufacturer Part Number: 0603SAJ0332T5E; Value: 3.3kΩ; Temperature Coefficient: 100ppm/°C; Supplier: Mouser; Supplier Part Number: 303-0603SAJ0332T5E; Category: Uncategorized; Pricing: 10000=0,001 (USD); RoHS: Non-Compliant; ComponentLink1URL: https://datasheet.octopart.com:443/0603SAJ0332T5E-Royal-Ohm-datasheet-165785611.pdf?src-supplier=TME; ComponentLink1Description: https://datasheet.octopart.com:443/0603SAJ0332T5E-Royal-Ohm-datasheet-165785611.pdf?src-supplier=TME; ComponentLink2URL: https://datasheet.octopart.com:443/0603SAJ0332T5E-Royal-Ohm-datasheet-157855877.pdf?src-supplier=TME; ComponentLink2Description: https://datasheet.octopart.com:443/0603SAJ0332T5E-Royal-Ohm-datasheet-157855877.pdf?src-supplier=TME; ComponentLink3URL: https://datasheet.octopart.com:443/0603SAJ0332T5E-Royal-Ohm-datasheet-62069544.pdf?src-supplier=TME; ComponentLink3Description: https://datasheet.octopart.com:443/0603SAJ0332T5E-Royal-Ohm-datasheet-62069544.pdf?src-supplier=TME; ComponentLink4URL: https://datasheet.octopart.com:443/0603SAJ0332T5E-Royal-Ohm-datasheet-17591902.pdf?src-supplier=TME; ComponentLink4Description: https://datasheet.octopart.com:443/0603SAJ0332T5E-Royal-Ohm-datasheet-17591902.pdf?src-supplier=TME; ComponentLink5Description: Tedarikçi; ComponentLink5URL: https://www.ozdisan.com/p/smt-smd-ve-cip-direncler-194/royalohm-0603saj0332t5e-336238
R12 R17 R24 R27 = RES 1kOhm %5 SMD 0603: (RC0603JR-071KL) SMD Chip Resistor, 1 kOhm, ï¿½ 5%, 100 mW, 0603 [1608 Metric], Thick Film, General Purpose; Manufacturer: Yageo; Value: 1kR; Temperature Coefficient: 100ppm/°C; Voltage Rating (DC): 50V; Power Rating: 100mW; Body Length: 1.6mm; Designed by: Eren/Mehmet; Supplier: Mouser; Supplier Part Number: 603-RC0603JR-071KL; Manufacturer Part Number: RC0603JR-071KL; RoHS: Yes; Category: Chip SMD Resistors; Stock: 1707256; Pricing: 1=0,1, 10=0,01, 50=0,01, 100=0,006, 1000=0,005, 10000=0,002 (USD); Case/Package: 0603; Pins: 2; Contact Plating: Tin,Matte; Case Code (Imperial): 0603; Case Code (Metric): 1608; Min Operating Temperature: -55°C; Max Operating Temperature: 155°C; Tolerance: 5%; Resistor Type: Thick Film; Packaging: Tape and Reel; Package Quantity: 5000; Voltage Rating: 50V; Termination: SMD/SMT; Series: RC; Resistance Tolerance: 5%; Construction: Rectangular; Max Power Dissipation: 100mW; Number of Terminations: 2; Voltage Rating (AC): 50V; Length: 1.6mm; Width: 0.8mm; Height: 0.45mm; Depth: 0.8mm; Reach SVHC Compliant: No; Lead Free: 5697LeadFree; Military Standard: Not; RoHS Compliant: Yes; ComponentLink1Description: https://ozdisan.com/pasif-komponentler/direncler/smt-smd-ve-cip-direncler/RC0603JR-071KL/534826; ComponentLink1URL: https://ozdisan.com/pasif-komponentler/direncler/smt-smd-ve-cip-direncler/RC0603JR-071KL/534826